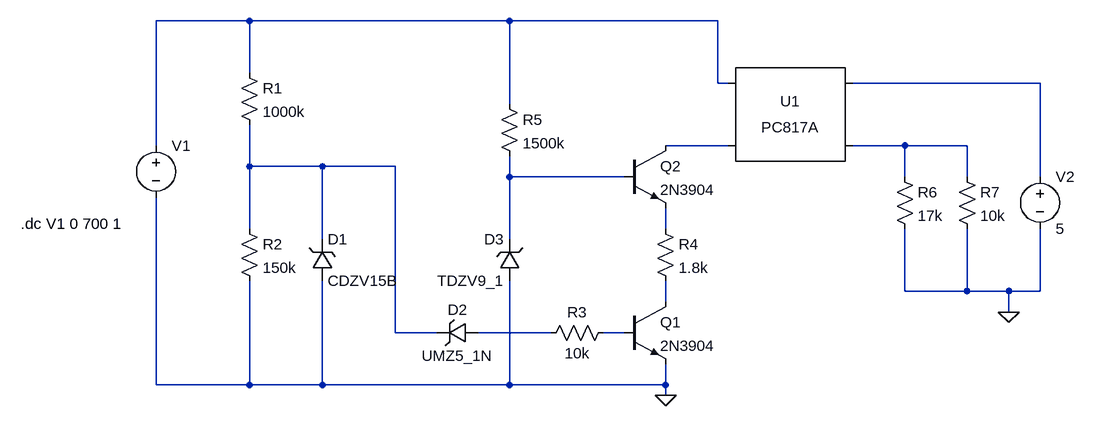
[diagram p0: schematic TSAL_hv_dc_detect.asc]
TSAL_hv_dc_detect.asc, the LTspice schematic file:
Version 4
SHEET 1 1368 680
WIRE 96 -112 -48 -112
WIRE 496 -112 96 -112
WIRE 816 -112 496 -112
WIRE 96 -32 96 -112
WIRE 816 -16 816 -112
WIRE 832 -16 816 -16
WIRE 1312 -16 1024 -16
WIRE 496 16 496 -112
WIRE -48 80 -48 -112
WIRE 832 80 736 80
WIRE 1104 80 1024 80
WIRE 1200 80 1104 80
WIRE 96 112 96 48
WIRE 208 112 96 112
WIRE 320 112 208 112
WIRE 496 128 496 96
WIRE 672 128 496 128
WIRE 1104 128 1104 80
WIRE 1200 128 1200 80
WIRE 1312 128 1312 -16
WIRE 96 208 96 112
WIRE 736 208 736 176
WIRE 208 224 208 112
WIRE 496 224 496 128
WIRE 1104 304 1104 208
WIRE 1200 304 1200 208
WIRE 1200 304 1104 304
WIRE 1264 304 1200 304
WIRE 1312 304 1312 208
WIRE 1312 304 1264 304
WIRE 736 320 736 288
WIRE 1264 336 1264 304
WIRE 320 368 320 112
WIRE 384 368 320 368
WIRE 560 368 448 368
WIRE 672 368 640 368
WIRE -48 448 -48 160
WIRE 96 448 96 288
WIRE 96 448 -48 448
WIRE 208 448 208 288
WIRE 208 448 96 448
WIRE 496 448 496 288
WIRE 496 448 208 448
WIRE 736 448 736 416
WIRE 736 448 496 448
WIRE 736 464 736 448
FLAG 1264 336 0
FLAG 736 464 0
SYMBOL voltage -48 64 R0
WINDOW 123 0 0 Left 0
WINDOW 39 0 0 Left 0
SYMATTR InstName V1
SYMATTR Value ""
SYMBOL res 80 -48 R0
SYMATTR InstName R1
SYMATTR Value 1000k
SYMBOL res 80 192 R0
SYMATTR InstName R2
SYMATTR Value 150k
SYMBOL zener 192 288 M180
WINDOW 0 24 64 Left 2
WINDOW 3 24 0 Left 2
SYMATTR InstName D1
SYMATTR Value CDZV15B
SYMBOL zener 448 384 M270
WINDOW 0 36 32 VTop 2
WINDOW 3 -4 32 VBottom 2
SYMATTR InstName D2
SYMATTR Value UMZ5_1N
SYMBOL res 656 352 R90
WINDOW 0 0 56 VBottom 2
WINDOW 3 32 56 VTop 2
SYMATTR InstName R3
SYMATTR Value 10k
SYMBOL npn 672 320 R0
SYMATTR InstName Q1
SYMATTR Value 2N3904
SYMBOL npn 672 80 R0
SYMATTR InstName Q2
SYMATTR Value 2N3904
SYMBOL res 720 192 R0
SYMATTR InstName R4
SYMATTR Value 1.8k
SYMBOL res 480 0 R0
SYMATTR InstName R5
SYMATTR Value 1500k
SYMBOL zener 512 288 R180
WINDOW 0 24 64 Left 2
WINDOW 3 24 0 Left 2
SYMATTR InstName D3
SYMATTR Value TDZV9_1
SYMBOL Optos\\PC817A 928 32 R0
SYMATTR InstName U1
SYMBOL voltage 1312 112 R0
WINDOW 123 0 0 Left 0
WINDOW 39 0 0 Left 0
SYMATTR InstName V2
SYMATTR Value 5
SYMBOL res 1088 112 R0
SYMATTR InstName R6
SYMATTR Value 17k
SYMBOL res 1184 112 R0
SYMATTR InstName R7
SYMATTR Value 10k
TEXT -256 200 Left 2 !.dc V1 0 700 1

The netlist it stands for:
* TSAL_hv_dc_detect.asc
V1 N001 0
R1 N001 N005 1000k
R2 N005 0 150k
D1 0 N005 CDZV15B
D2 N009 N005 UMZ5_1N
R3 N010 N009 10k
Q1 N008 N010 0 0 2N3904
Q2 N003 N006 N007 0 2N3904
R4 N007 N008 1.8k
R5 N001 N006 1500k
D3 0 N006 TDZV9_1
XU1 N001 N003 N002 N004 PC817 Igain=1m
V2 N002 0 5
R6 N004 0 17k
R7 N004 0 10k
.model D D
.lib standard.dio
.model NPN NPN
.model PNP PNP
.lib standard.bjt
.dc V1 0 700 1
.lib PC817.sub
.backanno
.end